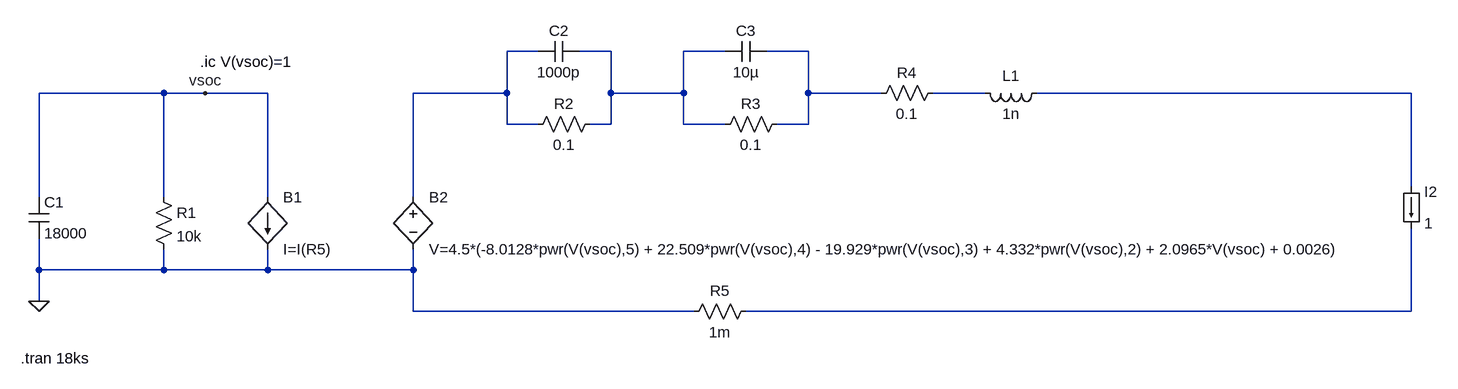
[diagram p0: schematic LiPo.asc]
LiPo.asc, the LTspice schematic file:
Version 4
SHEET 1 2284 680
WIRE 720 -80 672 -80
WIRE 832 -80 784 -80
WIRE 1008 -80 944 -80
WIRE 1136 -80 1072 -80
WIRE 144 -16 -48 -16
WIRE 208 -16 144 -16
WIRE 304 -16 208 -16
WIRE 672 -16 672 -80
WIRE 672 -16 528 -16
WIRE 832 -16 832 -80
WIRE 944 -16 944 -80
WIRE 944 -16 832 -16
WIRE 1136 -16 1136 -80
WIRE 1248 -16 1136 -16
WIRE 1408 -16 1328 -16
WIRE 2064 -16 1488 -16
WIRE 672 32 672 -16
WIRE 720 32 672 32
WIRE 832 32 832 -16
WIRE 832 32 800 32
WIRE 944 32 944 -16
WIRE 1008 32 944 32
WIRE 1136 32 1136 -16
WIRE 1136 32 1088 32
WIRE 2064 128 2064 -16
WIRE -48 144 -48 -16
WIRE 144 144 144 -16
WIRE 304 144 304 -16
WIRE 528 144 528 -16
WIRE -48 256 -48 208
WIRE 144 256 144 224
WIRE 144 256 -48 256
WIRE 304 256 304 224
WIRE 304 256 144 256
WIRE 528 256 528 224
WIRE 528 256 304 256
WIRE -48 304 -48 256
WIRE 528 320 528 256
WIRE 960 320 528 320
WIRE 2064 320 2064 192
WIRE 2064 320 1040 320
FLAG -48 304 0
FLAG 208 -16 vsoc
SYMBOL cap -64 144 R0
SYMATTR InstName C1
SYMATTR Value 18000
SYMBOL res 128 128 R0
SYMATTR InstName R1
SYMATTR Value 10k
SYMBOL cap 784 -96 R90
WINDOW 0 0 32 VBottom 2
WINDOW 3 32 32 VTop 2
SYMATTR InstName C2
SYMATTR Value 1000p
SYMBOL cap 1072 -96 R90
WINDOW 0 0 32 VBottom 2
WINDOW 3 32 32 VTop 2
SYMATTR InstName C3
SYMATTR Value 10µ
SYMBOL res 816 16 R90
WINDOW 0 0 56 VBottom 2
WINDOW 3 32 56 VTop 2
SYMATTR InstName R2
SYMATTR Value 0.1
SYMBOL res 1104 16 R90
WINDOW 0 0 56 VBottom 2
WINDOW 3 32 56 VTop 2
SYMATTR InstName R3
SYMATTR Value 0.1
SYMBOL res 1344 -32 R90
WINDOW 0 0 56 VBottom 2
WINDOW 3 32 56 VTop 2
SYMATTR InstName R4
SYMATTR Value 0.1
SYMBOL ind 1504 -32 R90
WINDOW 0 5 56 VBottom 2
WINDOW 3 32 56 VTop 2
SYMATTR InstName L1
SYMATTR Value 1n
SYMBOL res 1056 304 R90
WINDOW 0 0 56 VBottom 2
WINDOW 3 32 56 VTop 2
SYMATTR InstName R5
SYMATTR Value 1m
SYMBOL load 2048 128 R0
WINDOW 123 0 0 Left 0
WINDOW 39 0 0 Left 0
SYMATTR InstName I2
SYMATTR Value 1
SYMBOL bi 304 144 R0
SYMATTR InstName B1
SYMATTR Value I=I(R5)
SYMBOL bv 528 128 R0
SYMATTR InstName B2
SYMATTR Value V=4.5*(-8.0128*pwr(V(vsoc),5) + 22.509*pwr(V(vsoc),4) - 19.929*pwr(V(vsoc),3) + 4.332*pwr(V(vsoc),2) + 2.0965*V(vsoc) + 0.0026)
TEXT -76 392 Left 2 !.tran 18ks
TEXT 200 -64 Left 2 !.ic V(vsoc)=1

The netlist it stands for:
* LiPo.asc
C1 vsoc 0 18000
R1 vsoc 0 10k
C2 N002 N001 1000p
C3 N003 N002 10µ
R2 N002 N001 0.1
R3 N003 N002 0.1
R4 N004 N003 0.1
L1 N005 N004 1n
R5 N006 0 1m
I2 N005 N006 1
B1 vsoc 0 I=I(R5)
B2 N001 0 V=4.5*(-8.0128*pwr(V(vsoc),5) + 22.509*pwr(V(vsoc),4) - 19.929*pwr(V(vsoc),3) + 4.332*pwr(V(vsoc),2) + 2.0965*V(vsoc) + 0.0026)
.tran 18ks
.ic V(vsoc)=1
.backanno
.end